# Altium schematic sheet TestWiresScheme.SchDoc
size A
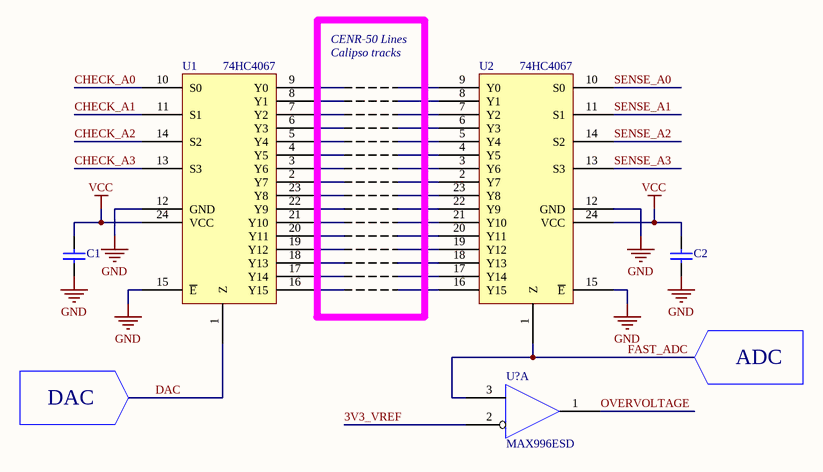
[diagram p0: TestWiresScheme.SchDoc]

## Parts
C1  Cap chip  [CAPC3216]  (value not drawn)
C2  Cap chip  [CAPC3216]  (value not drawn)
U1  74HC4067  [SO24]
U2  74HC4067  [SO24]
U?  MAX996ESD  [SOIC-14]  (part A of 4)

## Nets
GND: C1.1 C2.1 U1.12(GND) U1.15(~{E}) U2.12(GND) U2.15(~{E})
VCC: C1.2 C2.2 U1.24(VCC) U2.24(VCC)
3V3_VREF: U?.2(-IN1)
CHECK_A0: U1.10(S0)
CHECK_A1: U1.11(S1)
CHECK_A2: U1.14(S2)
CHECK_A3: U1.13(S3)
DAC: U1.1(Z)
FAST_ADC: U2.1(Z) U?.3(+IN1)
OVERVOLTAGE: U?.1(OUT1)
SENSE_A0: U2.10(S0)
SENSE_A1: U2.11(S1)
SENSE_A2: U2.14(S2)
SENSE_A3: U2.13(S3)

Not connected (* = marked no-connect by the designer): U1 2(Y7) 3(Y6) 4(Y5) 5(Y4) 6(Y3) 7(Y2) 8(Y1) 9(Y0) 16(Y15) 17(Y14) 18(Y13) 19(Y12) 20(Y11) 21(Y10) 22(Y9) 23(Y8); U2 2(Y7) 3(Y6) 4(Y5) 5(Y4) 6(Y3) 7(Y2) 8(Y1) 9(Y0) 16(Y15) 17(Y14) 18(Y13) 19(Y12) 20(Y11) 21(Y10) 22(Y9) 23(Y8)

## Notes on the sheet
- CENR-50 Lines
- Calipso tracks
- ADC
- DAC

## Library data of the parts
C1 C2 = Cap chip: Chip Capacitor; Value: 0.01uF; Published: 8-Jun-2000; LatestRevisionDate: 17-Jul-2002; LatestRevisionNote: Re-released for DXP Platform.; PackageReference: RAD-0.3; Publisher: Altium Limited; Supplier 1: Digi-Key; Supplier Part Number 1: 399-1249-1-ND
U1 U2 = 74HC4067; 74HCT4067: 16-channel analog multiplexer/demultiplexer
U? = MAX996ESD: High-Speed, Micropower, Low-Voltage,  Rail-to-Rail I/O Comparators